# EasyEDA Pro project 扩展板测试1.epro

# Board 电机驱动MX1616H
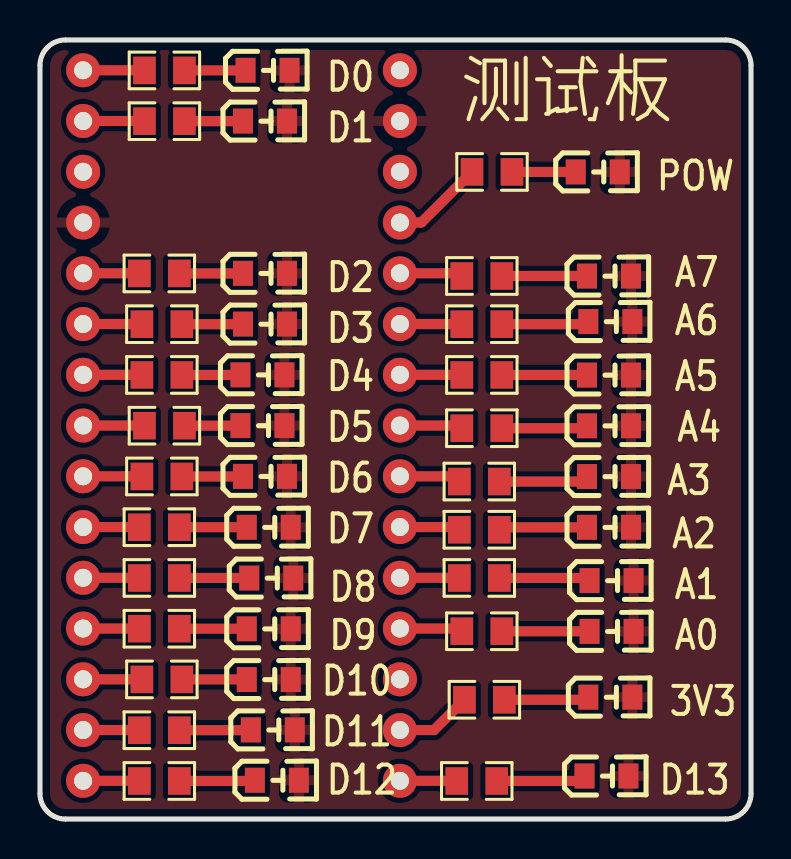
[diagram p0: board, top side]
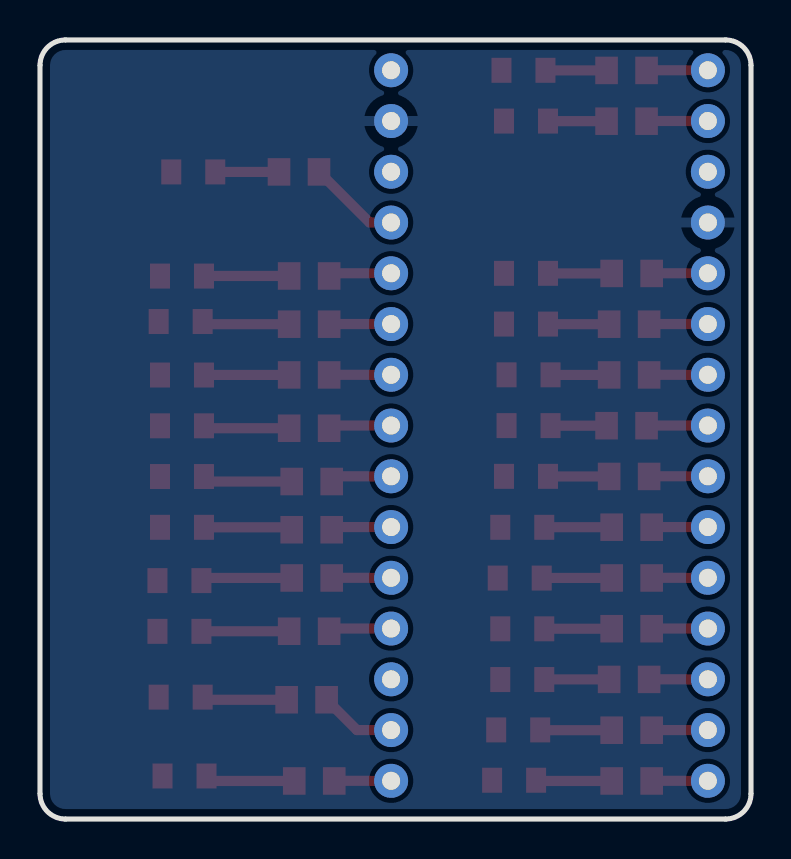
[diagram p1: board, bottom side, seen from below]

Outline 35.56 x 38.99 mm; copper layers: Top Layer, Bottom Layer. Coordinates in mm from the lower left corner of the outline.
Outline path: 0,37.72 0,1.27 arc(0.37,0.37) 1.27,0 34.29,0 arc(35.19,0.37) 35.56,1.27 35.56,37.72 arc(35.19,38.62) 34.29,38.99 1.27,38.99 arc(0.37,38.62) 0,37.72
Stack: Top Layer 0.0356mm / Dielectric1 0.32mm FR-4 er 4.8 / Bottom Layer 0.0356mm

## Design rules (mm)
template: 用户自定义配置
spacing Clearance (default): track to track 0.254, other pairs 0 to 0.254
track width Width (default): min 0.254, default 0.508, max 1.27
differential pair DiffPairsRouting (default): width min 0.381, default 0.381, max 0.381; gap min 0.254, default 0.254
via RoutingVias (default): diameter min 1.27, default 1.27, max 1.27; hole min 0.711, default 0.711, max 0.711

## Placement (name value [footprint] x y rotation side)
LED1  -  [LED_0805]  11.43 37.47 0 top
LED2  -  [LED_0805]  11.3 34.92 0 top
LED3  -  [LED_0805]  11.49 9.52 0 top
LED3#2  -  [LED_0805]  11.49 6.98 0 top
LED3#3  -  [LED_0805]  11.69 4.46 0 top
LED3#4  -  [LED_0805]  11.9 1.94 0 top
LED3#5  -  [LED_0805]  28.51 27.17 0 top
LED3#6  -  [LED_0805]  28.58 24.89 0 top
LED3#7  -  [LED_0805]  28.51 22.22 0 top
LED3#8  -  [LED_0805]  28.51 19.67 0 top
LED3#9  -  [LED_0805]  28.51 17.14 0 top
LED3#10  -  [LED_0805]  28.51 14.59 0 top
LED3#11  -  [LED_0805]  28.64 11.93 0 top
LED3#12  -  [LED_0805]  28.64 9.39 0 top
LED3#13  -  [LED_0805]  28.38 2.15 0 top
LED3#14  -  [LED_0805]  28.58 6.1 0 top
LED3#15  -  [LED_0805]  27.94 32.38 0 top
LED3#16  -  [LED_0805]  11.3 27.31 0 top
LED3#17  -  [LED_0805]  11.3 24.77 0 top
LED3#18  -  [LED_0805]  11.18 22.23 0 top
LED3#19  -  [LED_0805]  11.18 19.69 0 top
LED3#20  -  [LED_0805]  11.3 17.14 0 top
LED3#21  -  [LED_0805]  11.49 14.59 0 top
LED3#22  -  [LED_0805]  11.62 12.06 0 top
NOREF  -  [Pad_ie49]  2.16 4.45 90 top
NOREF#2  -  [Pad_ie30]  18 14.61 90 top
NOREF#3  -  [Pad_ie9]  2.16 14.61 90 top
NOREF#4  -  [Pad_ie16]  18 29.85 90 top
NOREF#5  -  [Pad_ie42]  18 1.91 90 top
NOREF#6  -  [Pad_ie50]  2.16 1.91 90 top
NOREF#7  -  [Pad_ie32]  18 9.53 90 top
NOREF#8  -  [Pad_ie11]  2.16 19.69 90 top
NOREF#9  -  [Pad_ie15]  18 32.39 90 top
NOREF#10  -  [Pad_ie40]  18 6.99 90 top
NOREF#11  -  [Pad_ie10]  2.16 27.31 90 top
NOREF#12  -  [Pad_ie23]  18 27.31 90 top
NOREF#13  -  [Pad_ie142]  2.16 17.15 90 top
NOREF#14  -  [Pad_ie143]  2.16 22.23 90 top
NOREF#15  -  [Pad_ie28]  2.16 34.93 90 top
NOREF#16  -  [Pad_ie45]  2.16 6.99 90 top
NOREF#17  -  [Pad_ie14]  18 34.93 90 top
NOREF#18  -  [Pad_ie41]  18 4.45 90 top
NOREF#19  -  [Pad_ie17]  2.16 24.77 90 top
NOREF#20  -  [Pad_ie13]  18 37.47 90 top
NOREF#21  -  [Pad_ie29]  18 17.15 90 top
NOREF#22  -  [Pad_ie44]  2.16 9.53 90 top
NOREF#23  -  [Pad_ie43]  2.16 12.07 90 top
NOREF#24  -  [Pad_ie27]  2.16 37.47 90 top
NOREF#25  -  [Pad_ie26]  18 19.69 90 top
NOREF#26  -  [Pad_ie6]  2.16 32.39 90 top
NOREF#27  -  [Pad_ie12]  2.16 29.85 90 top
NOREF#28  -  [Pad_ie25]  18 24.77 90 top
NOREF#29  -  [Pad_ie31]  18 12.07 90 top
NOREF#30  -  [Pad_ie24]  18 22.23 90 top
R1  -  [R0805]  22.22 5.97 0 top
R1#2  -  [R0805]  6.22 37.47 0 top
R1#3  -  [R0805]  6.22 34.92 0 top
R1#4  -  [R0805]  22.1 19.56 0 top
R1#5  -  [R0805]  21.97 16.89 0 top
R1#6  -  [R0805]  21.97 14.48 0 top
R1#7  -  [R0805]  21.97 12.06 0 top
R1#8  -  [R0805]  22.1 9.4 0 top
R1#9  -  [R0805]  21.84 1.91 0 top
R2  -  [R0805]  22.61 32.39 0 top
R2#2  -  [R0805]  22.1 27.18 0 top
R3  10K  [R0805]  22.1 24.77 0 top
R4  10K  [R0805]  22.1 22.23 0 top
R5  10K  [R0805]  5.97 27.31 0 top
R6  10K  [R0805]  6.1 24.77 0 top
R7  10K  [R0805]  6.1 22.23 0 top
R8  10K  [R0805]  6.22 19.69 0 top
R9  10K  [R0805]  6.1 17.14 0 top
R10  10K  [R0805]  5.97 14.61 0 top
R11  10K  [R0805]  5.97 12.06 0 top
R12  10K  [R0805]  5.97 9.53 0 top
R13  10K  [R0805]  6.1 6.99 0 top
R14  10K  [R0805]  5.97 4.45 0 top
R15  10K  [R0805]  5.97 1.91 0 top

## Footprints (pads in the part's own frame, mm; a bottom-side part is the same pattern mirrored in y, then rotated)
LED_0805
  rect 1x1.25 smd: 1(-1.15,0.005) 2(1.05,0.005)
Pad_ie6
  round 1.7 hole 0.9: 0(0,0)
Pad_ie9
  round 1.7 hole 0.9: 0(0,0)
Pad_ie10
  round 1.7 hole 0.9: 0(0,0)
Pad_ie11
  round 1.7 hole 0.9: 0(0,0)
Pad_ie12
  round 1.7 hole 0.9: 0(0,0)
Pad_ie13
  round 1.7 hole 0.9: 0(0,0)
Pad_ie14
  round 1.7 hole 0.9: 0(0,0)
Pad_ie15
  round 1.7 hole 0.9: 0(0,0)
Pad_ie16
  round 1.7 hole 0.9: 0(0,0)
Pad_ie17
  round 1.7 hole 0.9: 0(0,0)
Pad_ie23
  round 1.7 hole 0.9: 0(0,0)
Pad_ie24
  round 1.7 hole 0.9: 0(0,0)
Pad_ie25
  round 1.7 hole 0.9: 0(0,0)
Pad_ie26
  round 1.7 hole 0.9: 0(0,0)
Pad_ie27
  round 1.7 hole 0.9: 0(0,0)
Pad_ie28
  round 1.7 hole 0.9: 0(0,0)
Pad_ie29
  round 1.7 hole 0.9: 0(0,0)
Pad_ie30
  round 1.7 hole 0.9: 0(0,0)
Pad_ie31
  round 1.7 hole 0.9: 0(0,0)
Pad_ie32
  round 1.7 hole 0.9: 0(0,0)
Pad_ie40
  round 1.7 hole 0.9: 0(0,0)
Pad_ie41
  round 1.7 hole 0.9: 0(0,0)
Pad_ie42
  round 1.7 hole 0.9: 0(0,0)
Pad_ie43
  round 1.7 hole 0.9: 0(0,0)
Pad_ie44
  round 1.7 hole 0.9: 0(0,0)
Pad_ie45
  round 1.7 hole 0.9: 0(0,0)
Pad_ie49
  round 1.7 hole 0.9: 0(0,0)
Pad_ie50
  round 1.7 hole 0.9: 0(0,0)
Pad_ie142
  round 1.7 hole 0.9: 0(0,0)
Pad_ie143
  round 1.7 hole 0.9: 0(0,0)
R0805
  rect 1.133x1.377 smd: 1(-1,0) 2(1,0)

## Nets
3V3: NOREF#18.0 R1.1
GND: LED1.2 LED2.2 LED3.2 LED3#2.2 LED3#3.2 LED3#4.2 LED3#5.2 LED3#6.2 LED3#7.2 LED3#8.2 LED3#9.2 LED3#10.2 LED3#11.2 LED3#12.2 LED3#13.2 LED3#14.2 LED3#15.2 LED3#16.2 LED3#17.2 LED3#18.2 LED3#19.2 LED3#20.2 LED3#21.2 LED3#22.2 NOREF#17.0 NOREF#27.0
VDD: NOREF#4.0 R2.1
VIN: NOREF#20.0
333: LED3#14.1 R1.2
A0: NOREF#7.0 R1#8.1
A1: NOREF#29.0 R1#7.1
A2: NOREF#2.0 R1#6.1
A3: NOREF#21.0 R1#5.1
A4: NOREF#25.0 R1#4.1
A5: NOREF#30.0 R4.1
A6: NOREF#28.0 R3.1
A7: NOREF#12.0 R2#2.1
D2: NOREF#11.0 R5.1
D3: NOREF#19.0 R6.1
D4: NOREF#14.0 R7.1
D5: NOREF#8.0 R8.1
D6: NOREF#13.0 R9.1
D7: NOREF#3.0 R10.1
D8: NOREF#23.0 R11.1
D9: NOREF#22.0 R12.1
D10: NOREF#16.0 R13.1
D11: NOREF.0 R14.1
D12: NOREF#6.0 R15.1
D13: NOREF#5.0 R1#9.1
L0: LED1.1 R1#2.2
L1: LED2.1 R1#3.2
L2: LED3#16.1 R5.2
L3: LED3#17.1 R6.2
L4: LED3#18.1 R7.2
L5: LED3#19.1 R8.2
L6: LED3#20.1 R9.2
L7: LED3#21.1 R10.2
L8: LED3#22.1 R11.2
L9: LED3.1 R12.2
L10: LED3#2.1 R13.2
L11: LED3#3.1 R14.2
L12: LED3#4.1 R15.2
L13: LED3#13.1 R1#9.2
L14: LED3#12.1 R1#8.2
L15: LED3#11.1 R1#7.2
L16: LED3#10.1 R1#6.2
L17: LED3#9.1 R1#5.2
L18: LED3#8.1 R1#4.2
L19: LED3#7.1 R4.2
L20: LED3#6.1 R3.2
L21: LED3#5.1 R2#2.2
POW: LED3#15.1 R2.2
REF: NOREF#10.0
RST: NOREF#26.0
RX0: NOREF#15.0 R1#3.1
TX1: NOREF#24.0 R1#2.1

Pads without a net: NOREF#9 0

## Routing (per net, layer and track width the routed paths; a pad name or vN(x,y) marks a point on that pad's centre or on a via; arc(x,y) is an arc through that point)
3V3: length 3.9
  Top Layer w0.508: NOREF#18.0 19.71,4.45 R1.1
VDD: length 4.7
  Top Layer w0.508: NOREF#4.0 19.07,29.85 R2.1
333: length 4.3
  Top Layer w0.508: R1.2 27.29,5.97 LED3#14.1
A0: length 3.2
  Top Layer w0.508: NOREF#7.0 20.96,9.53 R1#8.1
A1: length 3
  Top Layer w0.508: R1#7.1 20.96,12.07 NOREF#29.0
A2: length 3
  Top Layer w0.508: R1#6.1 20.84,14.61 NOREF#2.0
A3: length 3.1
  Top Layer w0.508: R1#5.1 20.71,17.15 NOREF#21.0
A4: length 3.2
  Top Layer w0.508: R1#4.1 20.96,19.69 NOREF#25.0
A5: length 3.1
  Top Layer w0.508: R4.1 21.09,22.23 NOREF#30.0
A6: length 3.1
  Top Layer w0.508: NOREF#28.0 21.09,24.77 R3.1
A7: length 3.2
  Top Layer w0.508: NOREF#12.0 20.96,27.31 R2#2.1
D2: length 2.8
  Top Layer w0.508: NOREF#11.0 4.96,27.31 R5.1
D3: length 2.9
  Top Layer w0.508: NOREF#19.0 5.09,24.77 R6.1
D4: length 2.9
  Top Layer w0.508: NOREF#14.0 5.09,22.23 R7.1
D5: length 3.1
  Top Layer w0.508: R8.1 5.22,19.69 NOREF#8.0
D6: length 2.9
  Top Layer w0.508: R9.1 5.09,17.15 NOREF#13.0
D7: length 2.8
  Top Layer w0.508: NOREF#3.0 4.96,14.61 R10.1
D8: length 2.8
  Top Layer w0.508: R11.1 4.96,12.07 NOREF#23.0
D9: length 2.8
  Top Layer w0.508: NOREF#22.0 4.96,9.53 R12.1
D10: length 2.9
  Top Layer w0.508: R13.1 5.09,6.99 NOREF#16.0
D11: length 2.8
  Top Layer w0.508: R14.1 4.96,4.45 NOREF.0
D12: length 2.8
  Top Layer w0.508: R15.1 4.96,1.91 NOREF#6.0
D13: length 2.8
  Top Layer w0.508: R1#9.1 20.84,1.91 NOREF#5.0
L0: length 3.1
  Top Layer w0.508: LED1.1 10.27,37.47 R1#2.2
L1: length 2.9
  Top Layer w0.508: LED2.1 10.15,34.92 R1#3.2
L2: length 3.2
  Top Layer w0.508: LED3#16.1 10.15,27.31 R5.2
L3: length 3.1
  Top Layer w0.508: LED3#17.1 10.15,24.77 R6.2
L4: length 2.9
  Top Layer w0.508: LED3#18.1 10.02,22.23 R7.2
L5: length 2.8
  Top Layer w0.508: R8.2 10.02,19.69 LED3#19.1
L6: length 3.1
  Top Layer w0.508: R9.2 10.15,17.14 LED3#20.1
L7: length 3.4
  Top Layer w0.508: R10.2 10.34,14.61 10.34,14.6
L8: length 3.5
  Top Layer w0.508: 10.47,12.06 10.46,12.06 R11.2
L9: length 3.4
  Top Layer w0.508: R12.2 10.34,9.53 LED3.1
L10: length 3.2
  Top Layer w0.508: R13.2 10.33,6.99 LED3#2.1
L11: length 3.6
  Top Layer w0.508: LED3#3.1 10.53,4.45 R14.2
L12: length 3.8
  Top Layer w0.508: LED3#4.1 10.71,1.91 R15.2
L13: length 4.5
  Top Layer w0.508: 27.23,2.15 26.98,1.91 R1#9.2
L14: length 4.4
  Top Layer w0.508: LED3#12.1 27.48,9.4 R1#8.2
L15: length 4.6
  Top Layer w0.508: R1#7.2 27.35,12.06 LED3#11.1
L16: length 4.4
  Top Layer w0.508: 27.36,14.6 23.09,14.6 R1#6.2
L17: length 4.5
  Top Layer w0.508: LED3#9.1 27.11,16.89 R1#5.2
L18: length 4.3
  Top Layer w0.508: 27.36,19.68 27.24,19.56 R1#4.2
L19: length 4.3
  Top Layer w0.508: LED3#7.1 27.35,22.23 R4.2
L20: length 4.4
  Top Layer w0.508: R3.2 27.29,24.77 LED3#6.1
L21: length 4.3
  Top Layer w0.508: R2#2.2 27.35,27.18 LED3#5.1
POW: length 3.2
  Top Layer w0.508: R2.2 LED3#15.1
RX0: length 3.1
  Top Layer w0.508: R1#3.1 5.22,34.93 NOREF#15.0
TX1: length 3.1
  Top Layer w0.508: R1#2.1 5.22,37.47 NOREF#24.0

## Copper pours and planes (outline as drawn; the poured copper is in the pictures)
GND on Top Layer: -0.38,40.01 36.19,40.01 36.19,-1.14 -0.38,-1.14
GND on Bottom Layer: -0.89,41.28 37.08,41.28 37.08,-1.65 -0.89,-1.65

## Text on the board
Top Silkscreen Layer: D10 | D11 | D0 | D1 | D2 | D3 | D4 | D5 | D6 | D7 | D12 | D8 | D9 | POW | D13 | A3 | 3V3 | A2 | A7 | A6 | A5 | A1 | A0 | A4 | 测试板
